# EAGLE schematic FE3_V3_REV10c (EAGLE 9.3.2)
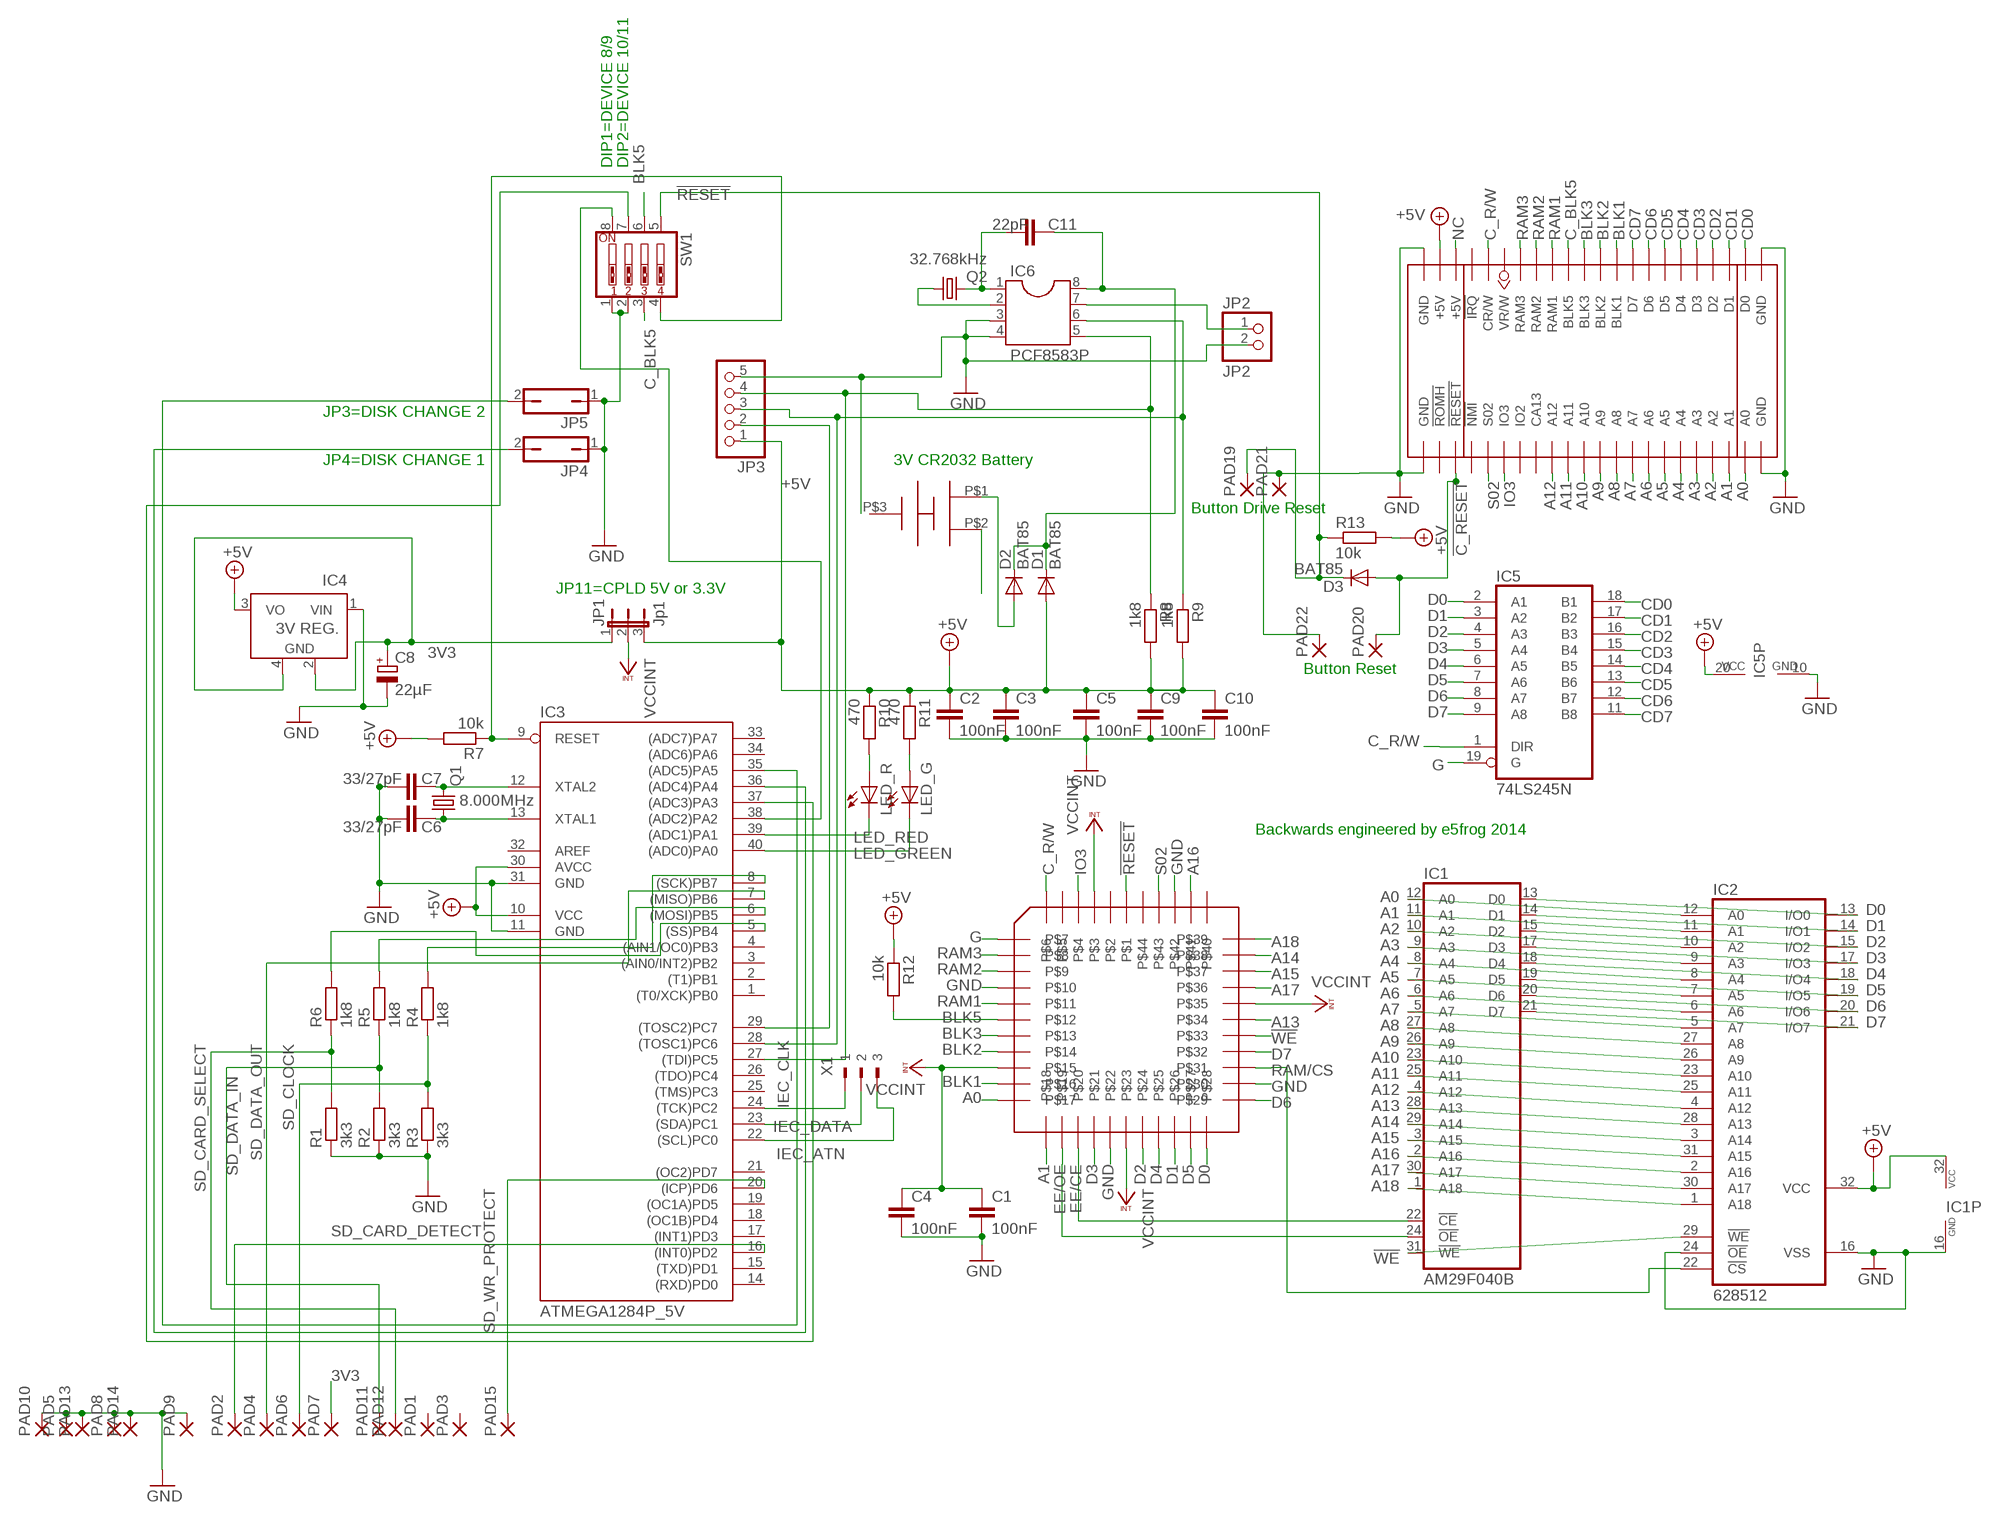
[diagram p0: schematic, sheet 1]

## Parts
C1  100nF  C-EU050-025X075  [C050-025X075]
C2  100nF  C-EU050-025X075  [C050-025X075]
C3  100nF  C-EU050-025X075  [C050-025X075]
C4  100nF  C-EU050-025X075  [C050-025X075]
C5  100nF  C-EU050-025X075  [C050-025X075]
C6  33/27pF  C-EU025-024X044  [C025-024X044]
C7  33/27pF  C-EU025-024X044  [C025-024X044]
C8  22µF  CPOL-EUE2-4  [E2-4]
C9  100nF  C-EU050-025X075  [C050-025X075]
C10  100nF  C-EU050-025X075  [C050-025X075]
C11  22pF  C5/2.5  [C5B2.5]
D1  BAT85  BAT81  [DO34-7]
D2  BAT85  BAT81  [DO34-7]
D3  BAT85  BAT81  [DO34-7]
IC1  AM29F040B  AM29F040PAM29F040B  [DIL32]
IC2  628512  628512P  [DIL32]
IC3  ATMEGA1284P_5V  MEGA32-P  [DIL40]
IC4  3V REG.  LM2936MP-3.0  [SOT223]
IC5  74LS245N  [DIL20]
IC6  PCF8583P  DIL8  [DIL08]
JP1  Jp1  JP2E_N  [JP2_N]
JP2  JP2  PINHD-1X2  [1X02]
JP3  PINHD-1X5  [1X05]
JP4  JP1Q  [JP1]
JP5  JP1Q  [JP1]
LED_G  LED3MM  [LED3MM]
LED_R  LED3MM  [LED3MM]
PAD1  SMD_EZ1  [SMD0,7-254]
PAD2  SMD_EZ1  [SMD0,7-254]
PAD3  SMD2  [SMD1,27-2,54]
PAD4  SMD2  [SMD1,27-2,54]
PAD5  SMD2  [SMD1,27-2,54]
PAD6  SMD2  [SMD1,27-2,54]
PAD7  SMD2  [SMD1,27-2,54]
PAD8  SMD2  [SMD1,27-2,54]
PAD9  SMD2  [SMD1,27-2,54]
PAD10  SMD2  [SMD1,27-2,54]
PAD11  SMD2  [SMD1,27-2,54]
PAD12  SMD2  [SMD1,27-2,54]
PAD13  SMD2  [SMD1,27-2,54]
PAD14  SMD2  [SMD1,27-2,54]
PAD15  SMD_EZ1  [SMD0,7-254]
PAD19  SMD5  [SMD2,54-5,08]
PAD20  SMD5  [SMD2,54-5,08]
PAD21  SMD5  [SMD2,54-5,08]
PAD22  SMD5  [SMD2,54-5,08]
Q1  8.000MHz  CRYSTALHC49U-V  [HC49U-V]
Q2  32.768kHz  CRYSTALTC26H  [TC26H]
R1  3k3  R-EU_0207/10  [0207/10]
R2  3k3  R-EU_0207/10  [0207/10]
R3  3k3  R-EU_0207/10  [0207/10]
R4  1k8  R-EU_0207/10  [0207/10]
R5  1k8  R-EU_0207/10  [0207/10]
R6  1k8  R-EU_0207/10  [0207/10]
R7  10k  R-EU_0207/10  [0207/10]
R8  1k8  R-EU_0207/10  [0207/10]
R9  1k8  R-EU_0207/10  [0207/10]
R10  470  R-EU_0207/10  [0207/10]
R11  470  R-EU_0207/10  [0207/10]
R12  10k  R-EU_0207/10  [0207/10]
R13  10k  R-EU_0207/10  [0207/10]
SW1  SW_DIP-4  [EDG-04]
U$1  CPLD-ATF1504-AS  [S44]
U$2  VIC-20_EXPANSION  [VIC-20_EXPANSION]
U$3  CR2032_RETAINER_PK5  [CR2032_RETAINER_PK5]
X1  90-3  [90-3]

## Nets
3V3: C8.+ IC4.2(GND) IC4.4(GND) JP1.1 PAD7.1(P)
!C_RESET: D3.A PAD20.1(P) U$2.P$25(!RESET)
!RESET: D3.C PAD19.1(P) R13.1 SW1.5 U$1.1
!WE: IC1.31(!WE) IC2.29(!WE) U$1.33
+5V: C2.1 C3.1 C5.1 C9.1 C10.1 D1.A IC1.32(VCC) IC2.32(VCC) IC3.10(VCC) IC3.30(AVCC) IC4.3(VO) IC5.20(VCC) JP1.3 JP3.1 R7.2 R8.2 R9.2 R10.1 R11.1 R12.1 R13.2 U$2.P$2(+5V)
A0: IC1.12(A0) IC2.12(A0) U$1.17 U$2.P$43(A0)
A1: IC1.11(A1) IC2.11(A1) U$1.18 U$2.P$42(A1)
A2: IC1.10(A2) IC2.10(A2) U$2.P$41(A2)
A3: IC1.9(A3) IC2.9(A3) U$2.P$40(A3)
A4: IC1.8(A4) IC2.8(A4) U$2.P$39(A4)
A5: IC1.7(A5) IC2.7(A5) U$2.P$38(A5)
A6: IC1.6(A6) IC2.6(A6) U$2.P$37(A6)
A7: IC1.5(A7) IC2.5(A7) U$2.P$36(A7)
A8: IC1.27(A8) IC2.27(A8) U$2.P$35(A8)
A9: IC1.26(A9) IC2.26(A9) U$2.P$34(A9)
A10: IC1.23(A10) IC2.23(A10) U$2.P$33(A10)
A11: IC1.25(A11) IC2.25(A11) U$2.P$32(A11)
A12: IC1.4(A12) IC2.4(A12) U$2.P$31(A12)
A13: IC1.28(A13) IC2.28(A13) U$1.34
A14: IC1.29(A14) IC2.3(A14) U$1.38
A15: IC1.3(A15) IC2.31(A15) U$1.37
A16: IC1.2(A16) IC2.2(A16) U$1.41
A17: IC1.30(A17) IC2.30(A17) U$1.36
A18: IC1.1(A18) IC2.1(A18) U$1.39
BLK1: U$1.16 U$2.P$13(BLK1)
BLK2: U$1.14 U$2.P$12(BLK2)
BLK3: U$1.13 U$2.P$11(BLK3)
BLK5: R12.2 SW1.6 U$1.12
C_BLK5: SW1.3 U$2.P$10(BLK5)
C_R/W: IC5.1(DIR) U$1.6 U$2.P$5(CR/W)
CD0: IC5.18(B1) U$2.P$21(D0)
CD1: IC5.17(B2) U$2.P$20(D1)
CD2: IC5.16(B3) U$2.P$19(D2)
CD3: IC5.15(B4) U$2.P$18(D3)
CD4: IC5.14(B5) U$2.P$17(D4)
CD5: IC5.13(B6) U$2.P$16(D5)
CD6: IC5.12(B7) U$2.P$15(D6)
CD7: IC5.11(B8) U$2.P$14(D7)
D0: IC1.13(D0) IC2.13(I/O0) IC5.2(A1) U$1.28
D1: IC1.14(D1) IC2.14(I/O1) IC5.3(A2) U$1.26
D2: IC1.15(D2) IC2.15(I/O2) IC5.4(A3) U$1.24
D3: IC1.17(D3) IC2.17(I/O3) IC5.5(A4) U$1.21
D4: IC1.18(D4) IC2.18(I/O4) IC5.6(A5) U$1.25
D5: IC1.19(D5) IC2.19(I/O5) IC5.7(A6) U$1.27
D6: IC1.20(D6) IC2.20(I/O6) IC5.8(A7) U$1.29
D7: IC1.21(D7) IC2.21(I/O7) IC5.9(A8) U$1.32
EE/CE: IC1.22(!CE) U$1.20
EE/OE: IC1.24(!OE) U$1.19
G: IC5.19(G) U$1.7
GND: C1.2 C2.2 C3.2 C4.2 C5.2 C6.2 C7.2 C8.- C9.2 C10.2 IC1.16(GND) IC2.16(VSS) IC2.24(!OE) IC3.11(GND) IC3.31(GND) IC4.1(VIN) IC5.10(GND) IC6.3 IC6.4 JP2.2 JP3.5 JP4.1 JP5.1 PAD5.1(P) PAD8.1(P) PAD9.1(P) PAD10.1(P) PAD13.1(P) PAD14.1(P) PAD21.1(P) PAD22.1(P) R1.1 R2.1 R3.1 SW1.1 SW1.2 U$1.10 U$1.22 U$1.30 U$1.42 U$2.P$1(GND) U$2.P$22(GND) U$2.P$23(GND) U$2.P$44(GND) U$3.P$2
IEC_ATN: IC3.22((SCL)PC0) X1.3
IEC_CLK: IC3.24((TCK)PC2) X1.1
IEC_DATA: IC3.23((SDA)PC1) X1.2
IO3: U$1.4 U$2.P$28(IO3)
LED_GREEN: IC3.40((ADC0)PA0) LED_G.K(C)
LED_RED: IC3.39((ADC1)PA1) LED_R.K(C)
N$1: IC3.37((ADC3)PA3) SW1.7
N$2: IC3.36((ADC4)PA4) JP4.2
N$3: IC3.35((ADC5)PA5) JP5.2
N$4: LED_R.A R10.2
N$5: IC3.38((ADC2)PA2) SW1.8
N$6: IC3.29((TOSC2)PC7) JP3.2
N$7: LED_G.A R11.2
N$8: IC3.27((TDI)PC5) IC6.5 JP3.4 R8.1
N$9: IC3.8((SCK)PB7) R4.2
N$10: IC3.6((MOSI)PB5) R5.2
N$11: IC3.5((SS)PB4) R6.2
N$12: IC3.9(RESET) R7.1 SW1.4
N$13: D2.A U$3.P$1
N$28: C7.1 IC3.12(XTAL2) Q1.2
N$29: C6.1 IC3.13(XTAL1) Q1.1
N$31: C11.1 D1.C D2.C IC6.8
N$32: C11.2 IC6.1 Q2.2
N$33: IC6.2 Q2.1
N$34: IC6.7 JP2.1
N$35: IC3.28((TOSC1)PC6) IC6.6 JP3.3 R9.1
NC: U$2.P$3(+5V)
RAM1: U$1.11 U$2.P$9(RAM1)
RAM2: U$1.9 U$2.P$8(RAM2)
RAM3: U$1.8 U$2.P$7(RAM3)
RAM/CS: IC2.22(!CS) U$1.31
S02: U$1.43 U$2.P$27(S02)
SD_CARD_DETECT: IC3.16((INT0)PD2) PAD2.1(P)
SD_CARD_SELECT: PAD12.1(P) R1.2 R6.1
SD_CLOCK: PAD6.1(P) R3.2 R4.1
SD_DATA_IN: PAD11.1(P) R2.2 R5.1
SD_DATA_OUT: IC3.7((MISO)PB6) PAD4.1(P)
SD_WR_PROTECT: IC3.20((ICP)PD6) PAD15.1(P)
VCCINT: C1.1 C4.1 JP1.2 U$1.3 U$1.15 U$1.23 U$1.35
Unconnected: IC3.1((T0/XCK)PB0) IC3.2((T1)PB1) IC3.3((AIN0/INT2)PB2) IC3.4((AIN1/OC0)PB3) IC3.14((RXD)PD0) IC3.15((TXD)PD1) IC3.17((INT1)PD3) IC3.18((OC1B)PD4) IC3.19((OC1A)PD5) IC3.21((OC2)PD7) IC3.25((TMS)PC3) IC3.26((TDO)PC4) IC3.32(AREF) IC3.33((ADC7)PA7) IC3.34((ADC6)PA6) PAD1.1(P) PAD3.1(P) U$1.2 U$1.5 U$1.40 U$1.44 U$2.P$4(!IRQ) U$2.P$6(VR/W) U$2.P$24(!ROMH) U$2.P$26(!NMI) U$2.P$29(IO2) U$2.P$30(CA13)

## Notes on the sheet
- DIP1=DEVICE 8/9 | DIP2=DEVICE 10/11
- JP3=DISK CHANGE 2
- JP4=DISK CHANGE 1 | 3V CR2032 Battery
- Button Drive Reset
- JP11=CPLD 5V or 3.3V
- Button Reset
- Backwards engineered by e5frog 2014

## Power pins joined to a net without a drawn wire
P$3: U$3.P$3

## Library data of the parts
C1-C7 C9 C10 = rcl:C-EU: CAPACITOR, European symbol
C8 = resistor:CPOL-EU: POLARIZED CAPACITOR, European symbol
C11 = capacitor-wima:C: CAPACITOR naming: grid - package width
D1-D3 = diode:BAT81: DIODE barrier diode
IC1 = am29-memory:AM29F040P: 4-Megabit FLASH MEMORY (512 K x 8 bit) 5 V-only
IC2 = memory-hitachi:628512P
IC3 = atmel:MEGA32-P: MICROCONTROLLER 32 Kbytes FLASH 2 Kbytes SRAM 1 Kbytes EEPROM USART 8-channel 10 bit ADC Source: www.atmel.com .. doc2503.pdf; MPN: ATMEGA32-16PU; OC_FARNELL: 1661729; OC_NEWARK: 51P1794
IC4 = national-semiconductor:LM2936MP?*: Ultra-Low Quiescent Current LDO Voltage Regulator Source: Data sheet <http://www.national.com/ds/LM/LM2936.pdf>; MF: NATIONAL SEMICONDUCTOR; MPN: LM2936MP-3.0/NOPB; OC_FARNELL: 1496125; OC_NEWARK: 41K4522
IC5 = 74xx-eu:74*245: Octal BUS TRANSCEIVER, 3-state
IC6 = ic-package:DIL8: Dual In Line / Socket
JP1 = jumper:JP2E: JUMPER
JP2 = pinhead:PINHD-1X2: PIN HEADER
JP3 = pinhead:PINHD-1X5: PIN HEADER
JP4 JP5 = jumper:JP1Q: JUMPER
LED_G LED_R = led:LED: LED OSRAM: - CHIPLED LG R971, LG N971, LY N971, LG Q971, LY Q971, LO R971, LY R971 LH N974, LH R974 LS Q976, LO Q976, LY Q976 LO Q996 - Hyper CHIPLED LW Q18S LB Q993, LB Q99A, LB R99A - SideLED LS A670, LO A670, LY A670, LG A670, LP A670 LB A673, LV A673, LT A673, LW A673 LH A674 LY A675 LS A676, LA A676, LO A676, LY A676, LW A676 LS A679, LY A679, LG A679 - Hyper Micro SIDELED® LS Y876, LA Y876, LO Y876, LY Y876 LT Y87S - SmartLED LW L88C, LW L88S LB L89C, LB L89S, LG L890 LS L89K, LO L89K, LY L89K LS L896, LA L896, LO L896, LY L896 - TOPLED LS T670, LO T670, LY T670, LG T670, LP T670 LSG T670, LSP T670, LSY T670, LOP T670, LYG T670 LG T671, LOG T671, LSG T671 LB T673, LV T673, LT T673, LW T673 LH T674 LS T676, LA T676, LO T676, LY T676, LB T676, LH T676, LSB T676, LW T676 LB T67C, LV T67C, LT T67C, LS T67K, LO T67K, LY T67K, LW E67C LS E67B, LA E67B, LO E67B, LY E67B, LB E67C, LV E67C, LT E67C LW T67C LS T679, LY T679, LG T679 LS T770, LO T770, LY T770, LG T770, LP T770 LB T773, LV T773, LT T773, LW T773 LH T774 LS E675, LA E675, LY E675, LS T675 LS T776, LA T776, LO T776, LY T776, LB T776 LHGB T686 LT T68C, LB T68C - Hyper Mini TOPLED® LB M676 - Mini TOPLED Santana® LG M470 LS M47K, LO M47K, LY M47K Source: http://www.osram.convergy.de LUXEON: - LUMILED® LXK2-PW12-R00, LXK2-PW12-S00, LXK2-PW14-U00, LXK2-PW14-V00 LXK2-PM12-R00, LXK2-PM12-S00, LXK2-PM14-U00 LXK2-PE12-Q00, LXK2-PE12-R00, LXK2-PE12-S00, LXK2-PE14-T00, LXK2-PE14-U00 LXK2-PB12-K00, LXK2-PB12-L00, LXK2-PB12-M00, LXK2-PB14-N00, LXK2-PB14-P00, LXK2-PB14-Q00 LXK2-PR12-L00, LXK2-PR12-M00, LXK2-PR14-Q00, LXK2-PR14-R00 LXK2-PD12-Q00, LXK2-PD12-R00, LXK2-PD12-S00 LXK2-PH12-R00, LXK2-PH12-S00 LXK2-PL12-P00, LXK2-PL12-Q00, LXK2-PL12-R00 Source: www.luxeon.com KINGBRIGHT: KA-3528ASYC Source: www.kingbright.com
PAD1 PAD2 PAD15 = SMD Pad:SMD_EZ1: SMD PAD
PAD3-PAD14 = wirepad:SMD2: SMD PAD
PAD19-PAD22 = wirepad:SMD5: SMD PAD
Q1 = crystal:CRYSTAL: CRYSTAL; OC_FARNELL: 1666969; OC_NEWARK: unknown
Q2 = crystal:CRYSTAL: CRYSTAL; OC_FARNELL: unknown; OC_NEWARK: unknown
R1-R13 = rcl:R-EU_: RESISTOR, European symbol
SW1 = special:SW_DIP-4: DIP SWITCH
U$1 = 000_e5frog:CPLD-ATF1504
U$2 = 000_e5frog:VIC-20_EXPANSION
U$3 = 000_e5frog:CR2032_RETAINER_PK5
X1 = con-weidmueller-sl35:90-3: WEIDMUELLER CLAMP CONNECTOR; OC_FARNELL: unknown; OC_NEWARK: unknown